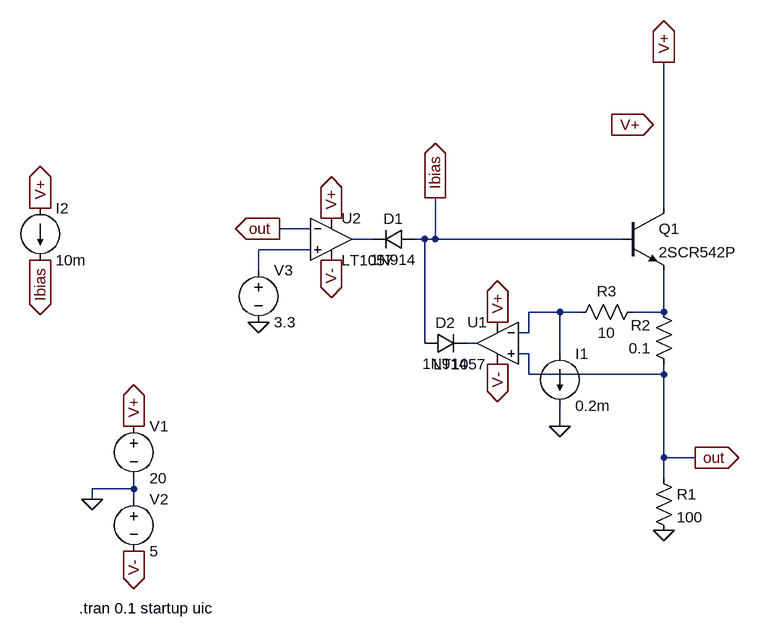
[diagram p0: schematic Draft3.asc]
Draft3.asc, the LTspice schematic file:
Version 4
SHEET 1 1220 680
WIRE 832 -224 832 -448
WIRE 288 -192 240 -192
WIRE 384 -176 352 -176
WIRE 464 -176 448 -176
WIRE 480 -176 480 -240
WIRE 480 -176 464 -176
WIRE 768 -176 480 -176
WIRE 288 -160 208 -160
WIRE 208 -128 208 -160
WIRE 672 -64 624 -64
WIRE 704 -64 672 -64
WIRE 832 -64 832 -128
WIRE 832 -64 784 -64
WIRE 624 -32 624 -64
WIRE 624 -32 608 -32
WIRE 464 -16 464 -176
WIRE 544 -16 528 -16
WIRE 624 0 608 0
WIRE 672 0 672 -64
WIRE 624 32 624 0
WIRE 832 32 832 16
WIRE 832 32 624 32
WIRE 672 112 672 80
WIRE 832 160 832 32
WIRE 880 160 832 160
WIRE 832 192 832 160
WIRE 16 208 16 192
WIRE 16 208 -48 208
WIRE -48 224 -48 208
WIRE 16 224 16 208
FLAG -48 224 0
FLAG 16 112 V+
IOPIN 16 112 Out
FLAG 320 -208 V+
IOPIN 320 -208 Out
FLAG 16 304 V-
IOPIN 16 304 Out
FLAG 320 -144 V-
IOPIN 320 -144 Out
FLAG 208 -48 0
FLAG 832 272 0
FLAG 832 -448 V+
IOPIN 832 -448 Out
FLAG 752 -352 V+
IOPIN 752 -352 Out
FLAG 880 160 out
IOPIN 880 160 Out
FLAG 672 112 0
FLAG -128 -224 V+
IOPIN -128 -224 Out
FLAG -128 -144 Ibias
IOPIN -128 -144 Out
FLAG 480 -240 Ibias
IOPIN 480 -240 Out
FLAG 240 -192 out
IOPIN 240 -192 Out
FLAG 576 -48 V+
IOPIN 576 -48 Out
FLAG 576 16 V-
IOPIN 576 16 Out
SYMBOL voltage 16 96 R0
WINDOW 123 0 0 Left 2
WINDOW 39 0 0 Left 2
SYMATTR InstName V1
SYMATTR Value 20
SYMBOL voltage 16 208 R0
WINDOW 123 0 0 Left 2
WINDOW 39 0 0 Left 2
SYMATTR InstName V2
SYMATTR Value 5
SYMBOL voltage 208 -144 R0
WINDOW 123 0 0 Left 2
WINDOW 39 0 0 Left 2
SYMATTR InstName V3
SYMATTR Value 3.3
SYMBOL npn 768 -224 R0
SYMATTR InstName Q1
SYMATTR Value 2SCR542P
SYMBOL res 816 176 R0
SYMATTR InstName R1
SYMATTR Value 100
SYMBOL res 848 32 R180
WINDOW 0 36 76 Left 2
WINDOW 3 36 40 Left 2
SYMATTR InstName R2
SYMATTR Value 0.1
SYMBOL res 800 -80 R90
WINDOW 0 0 56 VBottom 2
WINDOW 3 32 56 VTop 2
SYMATTR InstName R3
SYMATTR Value 10
SYMBOL Opamps\\LT1057 320 -240 R0
SYMATTR InstName U2
SYMBOL current 672 0 R0
WINDOW 123 0 0 Left 2
WINDOW 39 0 0 Left 2
SYMATTR InstName I1
SYMATTR Value 0.2m
SYMBOL current -128 -224 R0
WINDOW 123 0 0 Left 2
WINDOW 39 0 0 Left 2
SYMATTR InstName I2
SYMATTR Value 10m
SYMBOL diode 448 -192 R90
WINDOW 0 0 32 VBottom 2
WINDOW 3 32 32 VTop 2
SYMATTR InstName D1
SYMATTR Value 1N914
SYMBOL Opamps\\LT1057 576 -80 M0
SYMATTR InstName U1
SYMBOL diode 464 0 R270
WINDOW 0 32 32 VTop 2
WINDOW 3 0 32 VBottom 2
SYMATTR InstName D2
SYMATTR Value 1N914
TEXT -68 392 Left 2 !.tran 0.1 startup uic

The netlist it stands for:
* Draft3.asc
V1 V+ 0 20
V2 0 V- 5
V3 N002 0 3.3
Q1 V+ Ibias N004 0 2SCR542P
R1 out 0 100
R2 out N004 0.1
R3 N004 N003 10
XU2 N002 out V+ V- N001 LT1057  ; pins In+ In- V+ V- OUT
I1 N003 0 0.2m
I2 V+ Ibias 10m
D1 Ibias N001 1N914
XU1 out N003 V+ V- N005 LT1057  ; pins In+ In- V+ V- OUT
D2 Ibias N005 1N914
.model D D
.lib standard.dio
.model NPN NPN
.model PNP PNP
.lib standard.bjt
.tran 0.1 startup uic
.lib LTC.lib
.backanno
.end